# Altium schematic sheet Ethernet.SchDoc: Ethernet
size A4; SheetNumber: 5; SheetTotal: 6
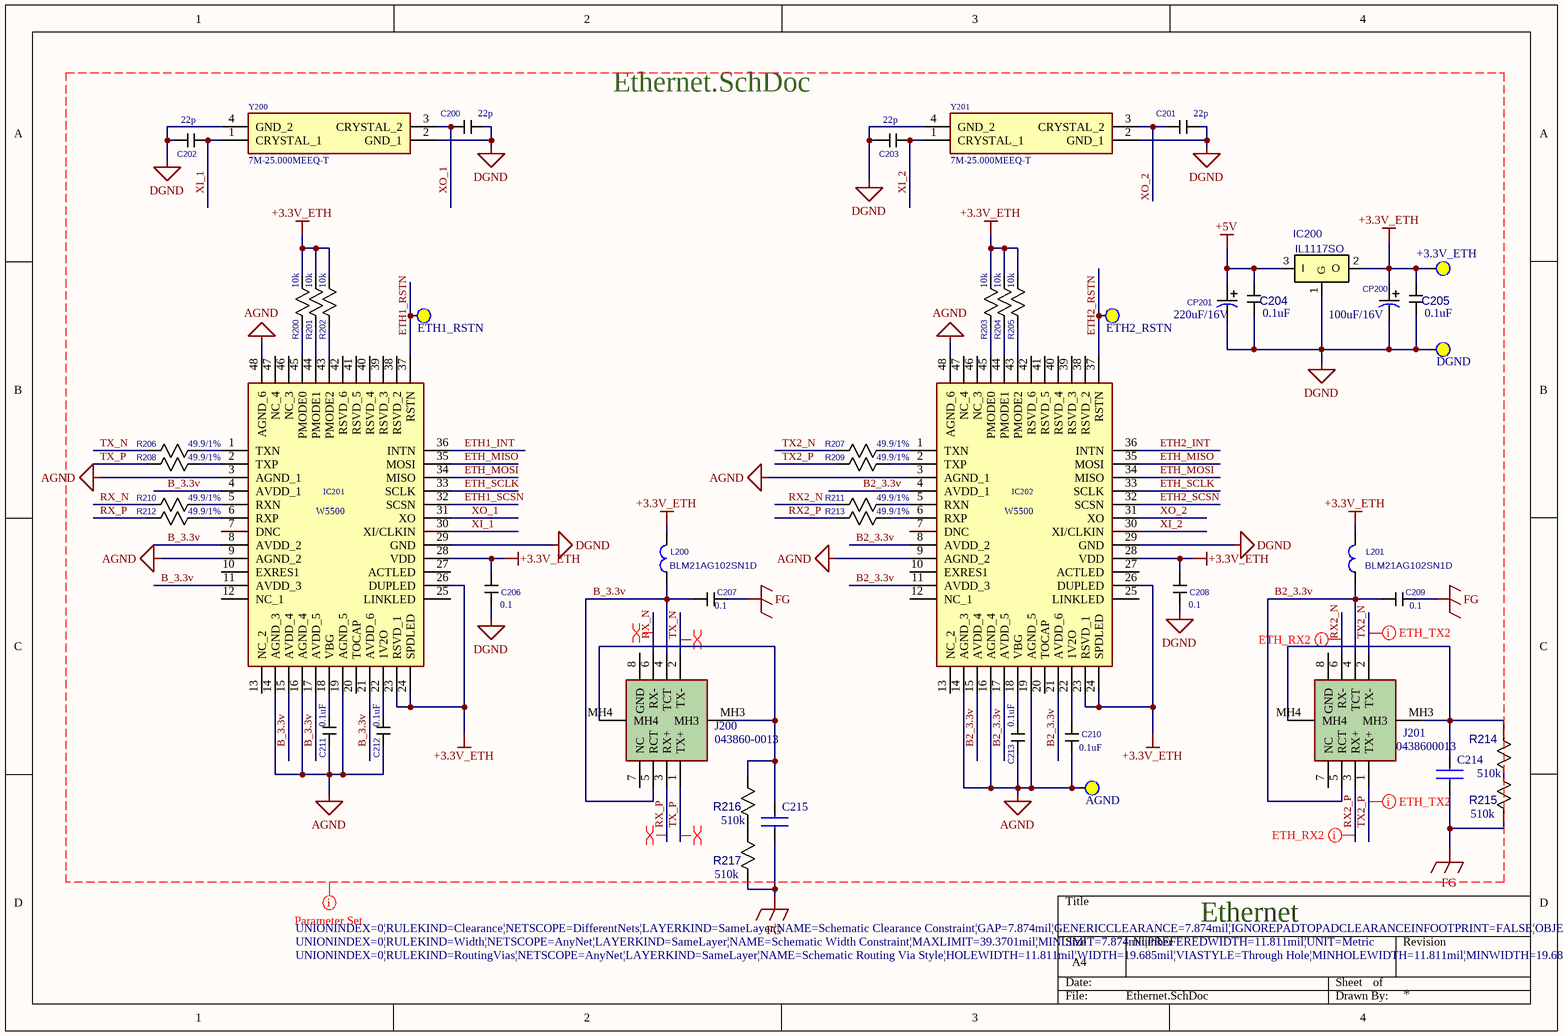
[diagram p0: Ethernet.SchDoc]

## Parts
+3.3V_ETH  Test Point_top  [TP_KEYSTONE_5000]  (value not drawn)
AGND  Test Point_top  [TP_KEYSTONE_5000]  (value not drawn)
C200  규격: 22p  [CC1608N]  (hidden comment: CS1608)
C201  규격: 22p  [CC1608N]  (hidden comment: CS1608)
C202  규격: 22p  [CC1608N]  (hidden comment: CS1608)
C203  규격: 22p  [CC1608N]  (hidden comment: CS1608)
C204  규격: 0.1uF  [CC1608N]  (hidden comment: CS1608)
C205  규격: 0.1uF  [CC1608N]  (hidden comment: CS1608)
C206  규격: 0.1  [CC1608N]  (hidden comment: CS1608)
C207  규격: 0.1  [CC1608N]  (hidden comment: CS1608)
C208  규격: 0.1  [CC1608N]  (hidden comment: CS1608)
C209  규격: 0.1  [CC1608N]  (hidden comment: CS1608)
C210  규격: 0.1uF  [CC1608N]  (hidden comment: CS1608)
C211  규격: 0.1uF  [CC1608N]  (hidden comment: CS1608)
C212  규격: 0.1uF  [CC1608N]  (hidden comment: CS1608)
C213  규격: 0.1uF  [CC1608N]  (hidden comment: CS1608)
C214  C4520X7R3D102K130KA  [C4520_Commercial]  (value not drawn)
C215  C4520X7R3D102K130KA  [C4520_Commercial]  (value not drawn)
CP200  규격: 100uF/16V  [CP5_SMT]  (hidden comment: CP5_SMT)
CP201  규격: 220uF/16V  [CP6_SMT]  (hidden comment: CP6_SMT)
DGND  Test Point_top  [TP_KEYSTONE_5000]  (value not drawn)
ETH1_RSTN  Test Point_top  [TP_KEYSTONE_5000]  (value not drawn)
ETH2_RSTN  Test Point_top  [TP_KEYSTONE_5000]  (value not drawn)
IC200  IL1117SO  [SOT-223]
IC201  W5500  [QFP50P900X900X160-48N]
IC202  W5500  [QFP50P900X900X160-48N]
J200  043860-0013  [0438600013]
J201  0438600013  [0438600013]
L200  BLM21AG102SN1D  [RESC1608X55N]
L201  BLM21AG102SN1D  [RESC1608X55N]
R200  규격: 10k  [RESC1608X55N]  (hidden comment: R1608)
R201  규격: 10k  [RESC1608X55N]  (hidden comment: R1608)
R202  규격: 10k  [RESC1608X55N]  (hidden comment: R1608)
R203  규격: 10k  [RESC1608X55N]  (hidden comment: R1608)
R204  규격: 10k  [RESC1608X55N]  (hidden comment: R1608)
R205  규격: 10k  [RESC1608X55N]  (hidden comment: R1608)
R206  규격: 49.9/1%  [RESC1608X55N]  (hidden comment: R1608)
R207  규격: 49.9/1%  [RESC1608X55N]  (hidden comment: R1608)
R208  규격: 49.9/1%  [RESC1608X55N]  (hidden comment: R1608)
R209  규격: 49.9/1%  [RESC1608X55N]  (hidden comment: R1608)
R210  규격: 49.9/1%  [RESC1608X55N]  (hidden comment: R1608)
R211  규격: 49.9/1%  [RESC1608X55N]  (hidden comment: R1608)
R212  규격: 49.9/1%  [RESC1608X55N]  (hidden comment: R1608)
R213  규격: 49.9/1%  [RESC1608X55N]  (hidden comment: R1608)
R214  규격: 510k  [R3216]  (hidden comment: R3216)
R215  규격: 510k  [R3216]  (hidden comment: R3216)
R216  규격: 510k  [R3216]  (hidden comment: R3216)
R217  규격: 510k  [R3216]  (hidden comment: R3216)
Y200  7M-25.000MEEQ-T  [7M25000MEEQT]
Y201  7M-25.000MEEQ-T  [7M25000MEEQT]

## Nets
+3.3V_ETH: +3.3V_ETH.1(tp) C205.2 C206.2 C208.2 CP200.2 IC200.2(O) IC201.23(RSVD_1) IC201.24(SPDLED) IC201.26(DUPLED) IC201.28(VDD) IC202.23(RSVD_1) IC202.24(SPDLED) IC202.26(DUPLED) IC202.28(VDD) L200.1 L201.1 R200.1 R201.1 R202.1 R203.1 R204.1 R205.1
+5V: C204.2 CP201.2 IC200.3(I)
AGND: AGND.1(tp) C210.2 C211.2 C212.2 C213.2 IC201.3(AGND_1) IC201.9(AGND_2) IC201.14(AGND_3) IC201.16(AGND_4) IC201.19(AGND_5) IC201.48(AGND_6) IC202.3(AGND_1) IC202.9(AGND_2) IC202.14(AGND_3) IC202.16(AGND_4) IC202.19(AGND_5) IC202.48(AGND_6)
DGND: C200.1 C201.1 C202.2 C203.2 C204.1 C205.1 C206.1 C208.1 CP200.1 CP201.1 DGND.1(tp) IC200.1(G) IC201.29(GND) IC202.29(GND) Y200.2(GND_1) Y200.4(GND_2) Y201.2(GND_1) Y201.4(GND_2)
FG: C207.1 C209.1 C214.2 C215.2 R215.1 R217.1
B2_3.3v: C209.2 IC202.4(AVDD_1) IC202.8(AVDD_2) IC202.11(AVDD_3) IC202.15(AVDD_4) IC202.17(AVDD_5) IC202.21(AVDD_6) J201.4(TCT) J201.5(RCT) L201.2
B_3.3v: C207.2 IC201.4(AVDD_1) IC201.8(AVDD_2) IC201.11(AVDD_3) IC201.15(AVDD_4) IC201.17(AVDD_5) IC201.21(AVDD_6) J200.4(TCT) J200.5(RCT) L200.2
ETH1_INT: IC201.36(INTN)
ETH1_RSTN: ETH1_RSTN.1(tp) IC201.37(RSTN)
ETH1_SCSN: IC201.32(SCSN)
ETH2_INT: IC202.36(INTN)
ETH2_RSTN: ETH2_RSTN.1(tp) IC202.37(RSTN)
ETH2_SCSN: IC202.32(SCSN)
ETH_MISO: IC201.35(MOSI) IC202.35(MOSI)
ETH_MOSI: IC201.34(MISO) IC202.34(MISO)
ETH_SCLK: IC201.33(SCLK) IC202.33(SCLK)
RX2_N: J201.6(RX-) R211.1
RX2_P: J201.3(RX+) R213.1
RX_N: J200.6(RX-) R210.1
RX_P: J200.3(RX+) R212.1
TX2_N: J201.2(TX-) R207.1
TX2_P: J201.1(TX+) R209.1
TX_N: J200.2(TX-) R206.1
TX_P: J200.1(TX+) R208.1
XI_1: C202.1 IC201.30(XI/CLKIN) Y200.1(CRYSTAL_1)
XI_2: C203.1 IC202.30(XI/CLKIN) Y201.1(CRYSTAL_1)
XO_1: C200.2 IC201.31(XO) Y200.3(CRYSTAL_2)
XO_2: C201.2 IC202.31(XO) Y201.3(CRYSTAL_2)
NetC210_1: C210.1 IC202.22(1V2O)
NetC211_1: C211.1 IC201.18(VBG)
NetC212_1: C212.1 IC201.22(1V2O)
NetC213_1: C213.1 IC202.18(VBG)
NetC214_1: C214.1 J201.MH3 J201.MH4 R214.2
NetC215_1: C215.1 J200.MH3 J200.MH4 R216.2
NetIC201_1: IC201.1(TXN) R206.2
NetIC201_2: IC201.2(TXP) R208.2
NetIC201_5: IC201.5(RXN) R210.2
NetIC201_6: IC201.6(RXP) R212.2
NetIC201_43: IC201.43(PMODE2) R202.2
NetIC201_44: IC201.44(PMODE1) R201.2
NetIC201_45: IC201.45(PMODE0) R200.2
NetIC202_1: IC202.1(TXN) R207.2
NetIC202_2: IC202.2(TXP) R209.2
NetIC202_5: IC202.5(RXN) R211.2
NetIC202_6: IC202.6(RXP) R213.2
NetIC202_43: IC202.43(PMODE2) R205.2
NetIC202_44: IC202.44(PMODE1) R204.2
NetIC202_45: IC202.45(PMODE0) R203.2
NetR214_1: R214.1 R215.2
NetR216_1: R216.1 R217.2

Not connected (* = marked no-connect by the designer): IC200 4; IC201 7(DNC) 10(EXRES1) 12(NC_1) 13(NC_2) 20(TOCAP) 25(LINKLED) 27(ACTLED) 38(RSVD_2) 39(RSVD_3) 40(RSVD_4) 41(RSVD_5) 42(RSVD_6) 46(NC_3) 47(NC_4); IC202 7(DNC) 10(EXRES1) 12(NC_1) 13(NC_2) 20(TOCAP) 25(LINKLED) 27(ACTLED) 38(RSVD_2) 39(RSVD_3) 40(RSVD_4) 41(RSVD_5) 42(RSVD_6) 46(NC_3) 47(NC_4); J200 7(NC) 8(GND); J201 7(NC) 8(GND)

## Layout directives
rule Clearance Constraint [Clearance = 0.2mm]; rule Width Constraint [Pref Width = 0.3mm    Min Width = 0.2mm    Max Width = 1mm]; rule Routing Via Style [Pref Size = 0.5mm    Pref Hole Size = 0.3mm]: +3.3V_ETH, +5V, AGND, B2_3.3v, B_3.3v, DGND, ETH1_INT, ETH1_RSTN, ETH1_SCSN, ETH2_INT, ETH2_RSTN, ETH2_SCSN, ETH_MISO, ETH_MOSI, ETH_SCLK, FG, RX2_N, RX2_P, RX_N, RX_P, TX2_N, TX2_P, TX_N, TX_P, XI_1, XI_2, XO_1, XO_2
differential pair: RX2_N, RX2_P, RX_N, RX_P, TX2_N, TX2_P, TX_N, TX_P

## Notes on the sheet
- Ethernet.SchDoc

## Library data of the parts
+3.3V_ETH AGND DGND ETH1_RSTN ETH2_RSTN = Tp_5000: Pad30; Part No.: *
C200-C203 = CS1608: Part No.: 0603N220J500; Price: 6
C204-C213 = CS1608: Part No.: {Part No}; Price: 6
C214 C215 = C4520X7R3D102K130KA: Capacitor; Manufacturer_Name: TDK; Datasheet Link: https://product.tdk.com/system/files/dam/doc/product/capacitor/ceramic/mlcc/catalog/mlcc_commercial_highvoltage_en.pdf; Height: 1mm; Part No.: C4520X7R3D102K130KA; Mouser Part Number: 810-C4520X7R3D102K; Mouser Price/Stock: https://www.mouser.co.uk/ProductDetail/TDK/C4520X7R3D102K130KA?qs=NRhsANhppD%2FmDDEB06mgKg%3D%3D; Arrow Part Number: C4520X7R3D102K130KA; Arrow Price/Stock: https://www.arrow.com/en/products/c4520x7r3d102k130ka/tdk?utm_currency=USD&region=nac
CP200 = CP5_SMT: Part No.: {Part No}; Price: 31
CP201 = CP6_SMT: Part No.: RV16V220 6.3X7.7 (ELNA / 삼영); ComponentLink1Description: New link; ComponentLink1URL: *; Price: 40
IC200 = 1117SO: Part No.: IL1117-3.3V; Value: 3.3V/1A; Price: 150
IC201 IC202 = W5500: Integrated Circuit; Manufacturer_Name: Wiznet Technology; Height: 1.6mm; Part No.: W5500; Price: 2480
J200 J201 = 0438600013: Connector; Height: 13.78mm; Part No.: 0438600013; Price: 5380
L200 L201 = BEAD2012: Part No.: BLM21AG102SN1D; Price: 92
R200-R205 = R1608: Part No.: WR06X103JT(10KR)J; Price: 1.0
R206-R213 = R1608: Part No.: {Part No}; Price: 2.5
R214-R217 = R3216: Part No.: WR12X514JT(510KR)J; Price: 2.1
Y200 = 7M-25.000MEEQ-T: Crystal or Oscillator; Manufacturer_Name: TXC CORPORATION; Datasheet Link: https://www.txccrystal.com/images/pdf/7m-accuracy.pdf; Height: 0.8mm; Manufacturer_Part_Number: 7M-25.000MEEQ-T; Mouser Part Number: 717-7M-25.000MEEQ-T; Price: 1540; Part No.: 7M-25.000MEEQ-T; Arrow Price/Stock: https://www.arrow.com/en/products/7m-25.000meeq-t/txc-corporation?region=nac
Y201 = 7M-25.000MEEQ-T: Crystal or Oscillator; Height: 0.8mm; Price: 1540; Part No.: 7M-25.000MEEQ-T